# EAGLE schematic 2MosfetV1 (EAGLE 9.3.0)
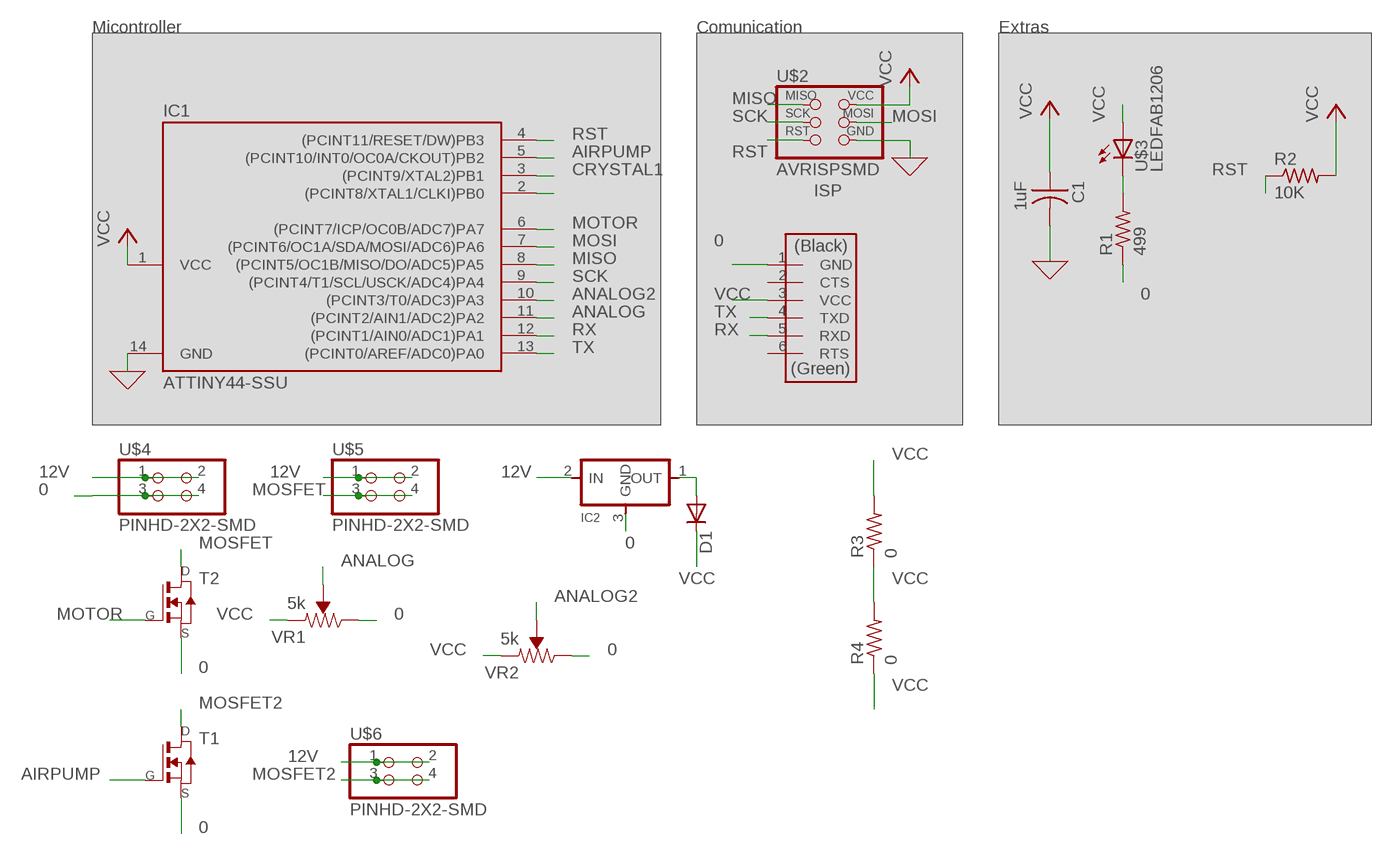
[diagram p0: schematic, sheet 1]

## Parts
C1  1uF  CAP-US1206FAB  [C1206FAB]
D1  DIODESOD123  [SOD123]
IC1  ATTINY44-SSU  [SOIC14]
IC2  REGULATORSOT23  [SOT23]
R1  499  RES-US1206FAB  [R1206FAB]
R2  10K  RES-US1206FAB  [R1206FAB]
R3  0  RES-US1206FAB  [R1206FAB]
R4  0  RES-US1206FAB  [R1206FAB]
T1  NMOSFETTO252  [TO252]
T2  NMOSFETTO252  [TO252]
U$1  FTDI-SMD-HEADER  [1X06SMD]
U$2  AVRISPSMD  [2X03SMD]
U$3  LEDFAB1206  [LED1206FAB]
U$4  PINHD-2X2-SMD  [2X02SMD]
U$5  PINHD-2X2-SMD  [2X02SMD]
U$6  PINHD-2X2-SMD  [2X02SMD]
VR1  5k  TRIMPOT-SMD-5MM-CLOSED-1/4W-20%  [TRIMPOT-SMD-5MM]
VR2  5k  TRIMPOT-SMD-5MM-CLOSED-1/4W-20%  [TRIMPOT-SMD-5MM]

## Nets
0: C1.2 IC1.14(GND) IC2.3(GND) R1.1 T1.2(S) T2.2(S) U$1.1(GND) U$2.6(GND) U$4.3 U$4.4 VR1.C(CW) VR2.C(CW) ; supply symbol labelled GND
12V: IC2.2(IN) U$4.1 U$4.2 U$5.1 U$5.2 U$6.1 U$6.2
AIRPUMP: IC1.5((PCINT10/INT0/OC0A/CKOUT)PB2) T1.1(G)
ANALOG: IC1.11((PCINT2/AIN1/ADC2)PA2) VR1.B(WIPER)
ANALOG2: IC1.10((PCINT3/T0/ADC3)PA3) VR2.B(WIPER)
CRYSTAL1: IC1.3((PCINT9/XTAL2)PB1)
MISO: IC1.8((PCINT5/OC1B/MISO/DO/ADC5)PA5) U$2.1(MISO)
MOSFET: T2.3(D) U$5.3 U$5.4
MOSFET2: T1.3(D) U$6.3 U$6.4
MOSI: IC1.7((PCINT6/OC1A/SDA/MOSI/ADC6)PA6) U$2.4(MOSI)
MOTOR: IC1.6((PCINT7/ICP/OC0B/ADC7)PA7) T2.1(G)
N$1: R1.2 U$3.2(C)
N$7: IC1.2((PCINT8/XTAL1/CLKI)PB0)
N$11: D1.ANODE(A) IC2.1(OUT)
RST: IC1.4((PCINT11/RESET/DW)PB3) R2.1 U$2.5(RST)
RX: IC1.12((PCINT1/AIN0/ADC1)PA1) U$1.5(RXD)
SCK: IC1.9((PCINT4/T1/SCL/USCK/ADC4)PA4) U$2.3(SCK)
TX: IC1.13((PCINT0/AREF/ADC0)PA0) U$1.4(TXD)
VCC: C1.1 D1.CATHODE(C) IC1.1(VCC) R2.2 R3.1 R3.2 R4.1 R4.2 U$1.3(VCC) U$2.2(VCC) U$3.1(A) VR1.A(CCW) VR2.A(CCW)
Unconnected: U$1.2(CTS) U$1.6(RTS)

## Notes on the sheet
- Micontroller | Comunication | Extras
- ISP

## Library data of the parts
C1 = fab:CAP-US
D1 = fab:DIODE: DIODE high speed (Philips)
IC1 = fab:ATTINY44
IC2 = fab:REGULATOR
R1-R4 = fab:RES-US: Resistor (US Symbol) Variants with postfix FAB are widened to allow the routing of internal traces
T1 T2 = fab:NMOSFET: MOS FET
U$1 = fab:FTDI-SMD-HEADER
U$2 = fab:AVRISP
U$3 = fab:LED: LED
U$4-U$6 = fab:PINHD-2X2-SMD
VR1 VR2 = SparkFun-Resistors:TRIMPOT: Trimming Potentiometer (Trimpot) Three-terminal potentiometers, with an adjustable wiper and two adjustable resistors. A pot can be used to create a configurable voltage divider, or as a variable resistor. "Trimpots" are a subset of potentiometers, usually intended for "set-and-forget" applications. They're often more delicate than standard potentiometers - rated for fewer turns. Variants PTH-KNOB - PTH Trimpot w/ finger-adjustable knob Trimpot 10K with Knob <https://www.sparkfun.com/products/9806> (COM-09806) Datasheet <http://www.sparkfun.com/datasheets/Components/General/TSR-3386.pdf> SMD-3MM-CLOSED-FRAME - SMD 3mm Square Closed-Frame Trimpot Used on e.g. EasyDriver - Stepper Motor Driver <https://www.sparkfun.com/products/12779> Datasheet <http://www.bitechnologies.com/pdfs/22.pdf> (22AR10KTR) SMD-5MM - SMD 5mm Square Closed-Frame Trimpot Used on e.g. IOIO-OTG - V2.2 <https://www.sparkfun.com/products/13613> Datasheet <http://www.vishay.com/docs/51008/ts53.pdf> (TS53YL502MR10) SMD-3MM-1/10W-25% - 3mm Square Open-Frame Trimpot Used on e.g. SparkFun Shapeoko <https://www.sparkfun.com/products/13899> Datasheet <http://www.bourns.com/docs/Product-Datasheets/TC33.pdf> (TC33X-2-103E); PROD_ID: RES-11156